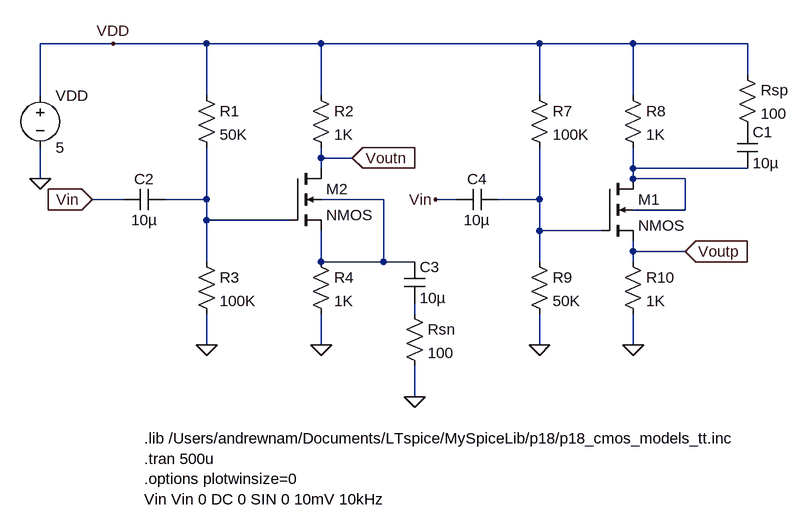
[diagram p0: schematic common_source_amplifier.asc]
common_source_amplifier.asc, the LTspice schematic file:
Version 4
SHEET 1 1348 680
WIRE 192 -16 80 -16
WIRE 336 -16 192 -16
WIRE 512 -16 336 -16
WIRE 848 -16 512 -16
WIRE 992 -16 848 -16
WIRE 1168 -16 992 -16
WIRE 1168 32 1168 -16
WIRE 80 64 80 -16
WIRE 336 64 336 -16
WIRE 512 64 512 -16
WIRE 848 64 848 -16
WIRE 992 64 992 -16
WIRE 512 160 512 144
WIRE 560 160 512 160
WIRE 512 176 512 160
WIRE 992 176 992 144
WIRE 1168 176 992 176
WIRE 80 192 80 144
WIRE 992 192 992 176
WIRE 1072 192 992 192
WIRE 208 224 160 224
WIRE 336 224 336 144
WIRE 336 224 272 224
WIRE 608 224 512 224
WIRE 720 224 688 224
WIRE 848 224 848 144
WIRE 848 224 784 224
WIRE 1072 240 1072 192
WIRE 1072 240 992 240
WIRE 336 256 336 224
WIRE 464 256 336 256
WIRE 848 272 848 224
WIRE 944 272 848 272
WIRE 992 304 992 288
WIRE 1072 304 992 304
WIRE 336 320 336 256
WIRE 512 320 512 272
WIRE 608 320 608 224
WIRE 608 320 512 320
WIRE 656 320 608 320
WIRE 848 320 848 272
WIRE 992 320 992 304
WIRE 656 400 656 384
WIRE 336 448 336 400
WIRE 512 448 512 400
WIRE 848 448 848 400
WIRE 992 448 992 400
WIRE 656 528 656 480
FLAG 80 192 0
FLAG 336 448 0
FLAG 512 448 0
FLAG 656 528 0
FLAG 848 448 0
FLAG 992 448 0
FLAG 192 -16 VDD
FLAG 160 224 Vin
IOPIN 160 224 In
FLAG 688 224 Vin
FLAG 560 160 Voutn
IOPIN 560 160 In
FLAG 1072 304 Voutp
IOPIN 1072 304 In
SYMBOL voltage 80 48 R0
SYMATTR InstName VDD
SYMATTR Value 5
SYMBOL res 320 48 R0
SYMATTR InstName R1
SYMATTR Value 50K
SYMBOL res 496 48 R0
SYMATTR InstName R2
SYMATTR Value 1K
SYMBOL res 320 304 R0
SYMATTR InstName R3
SYMATTR Value 100K
SYMBOL res 496 304 R0
SYMATTR InstName R4
SYMATTR Value 1K
SYMBOL res 640 384 R0
SYMATTR InstName Rsn
SYMATTR Value 100
SYMBOL res 832 48 R0
SYMATTR InstName R7
SYMATTR Value 100K
SYMBOL res 976 48 R0
SYMATTR InstName R8
SYMATTR Value 1K
SYMBOL res 1152 16 R0
SYMATTR InstName Rsp
SYMATTR Value 100
SYMBOL res 832 304 R0
SYMATTR InstName R9
SYMATTR Value 50K
SYMBOL res 976 304 R0
SYMATTR InstName R10
SYMATTR Value 1K
SYMBOL cap 1152 112 R0
SYMATTR InstName C1
SYMATTR Value 10µ
SYMBOL cap 272 208 R90
WINDOW 0 0 32 VBottom 2
WINDOW 3 32 32 VTop 2
SYMATTR InstName C2
SYMATTR Value 10µ
SYMBOL cap 640 320 R0
SYMATTR InstName C3
SYMATTR Value 10µ
SYMBOL cap 784 208 R90
WINDOW 0 0 32 VBottom 2
WINDOW 3 32 32 VTop 2
SYMATTR InstName C4
SYMATTR Value 10µ
SYMBOL nmos4 944 192 R0
SYMATTR InstName M1
SYMATTR Value2 l=0.18u w=10u
SYMBOL nmos4 464 176 R0
SYMATTR InstName M2
SYMATTR Value2 l=0.18u w=10u
TEXT 240 592 Left 2 !.lib /Users/andrewnam/Documents/LTspice/MySpiceLib/p18/p18_cmos_models_tt.inc\n.tran 500u\n.options plotwinsize=0\nVin Vin 0 DC 0 SIN 0 10mV 10kHz

The netlist it stands for:
* common_source_amplifier.asc
VDD VDD 0 5
R1 VDD N002 50K
R2 VDD Voutn 1K
R3 N002 0 100K
R4 N003 0 1K
Rsn N005 0 100
R7 VDD N004 100K
R8 VDD N001 1K
Rsp VDD P001 100
R9 N004 0 50K
R10 Voutp 0 1K
C1 P001 N001 10µ
C2 N002 Vin 10µ
C3 N003 N005 10µ
C4 N004 Vin 10µ
M1 N001 N004 Voutp N001 NMOS l=0.18u w=10u
M2 Voutn N002 N003 N003 NMOS l=0.18u w=10u
.model NMOS NMOS
.model PMOS PMOS
.lib standard.mos
.lib /Users/andrewnam/Documents/LTspice/MySpiceLib/p18/p18_cmos_models_tt.inc
.tran 500u
.options plotwinsize=0
Vin Vin 0 DC 0 SIN 0 10mV 10kHz
.backanno
.end